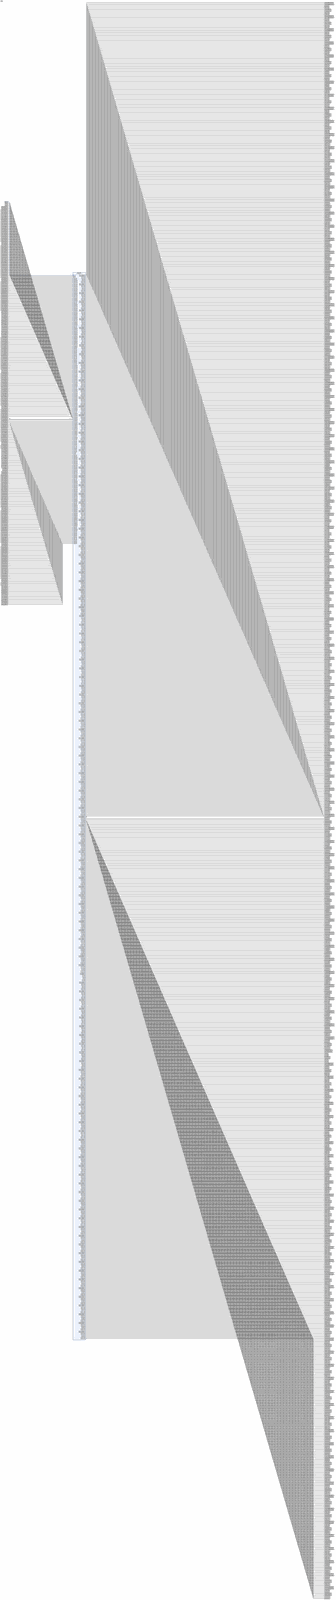
[diagram p0: block diagram of the top level, whole]
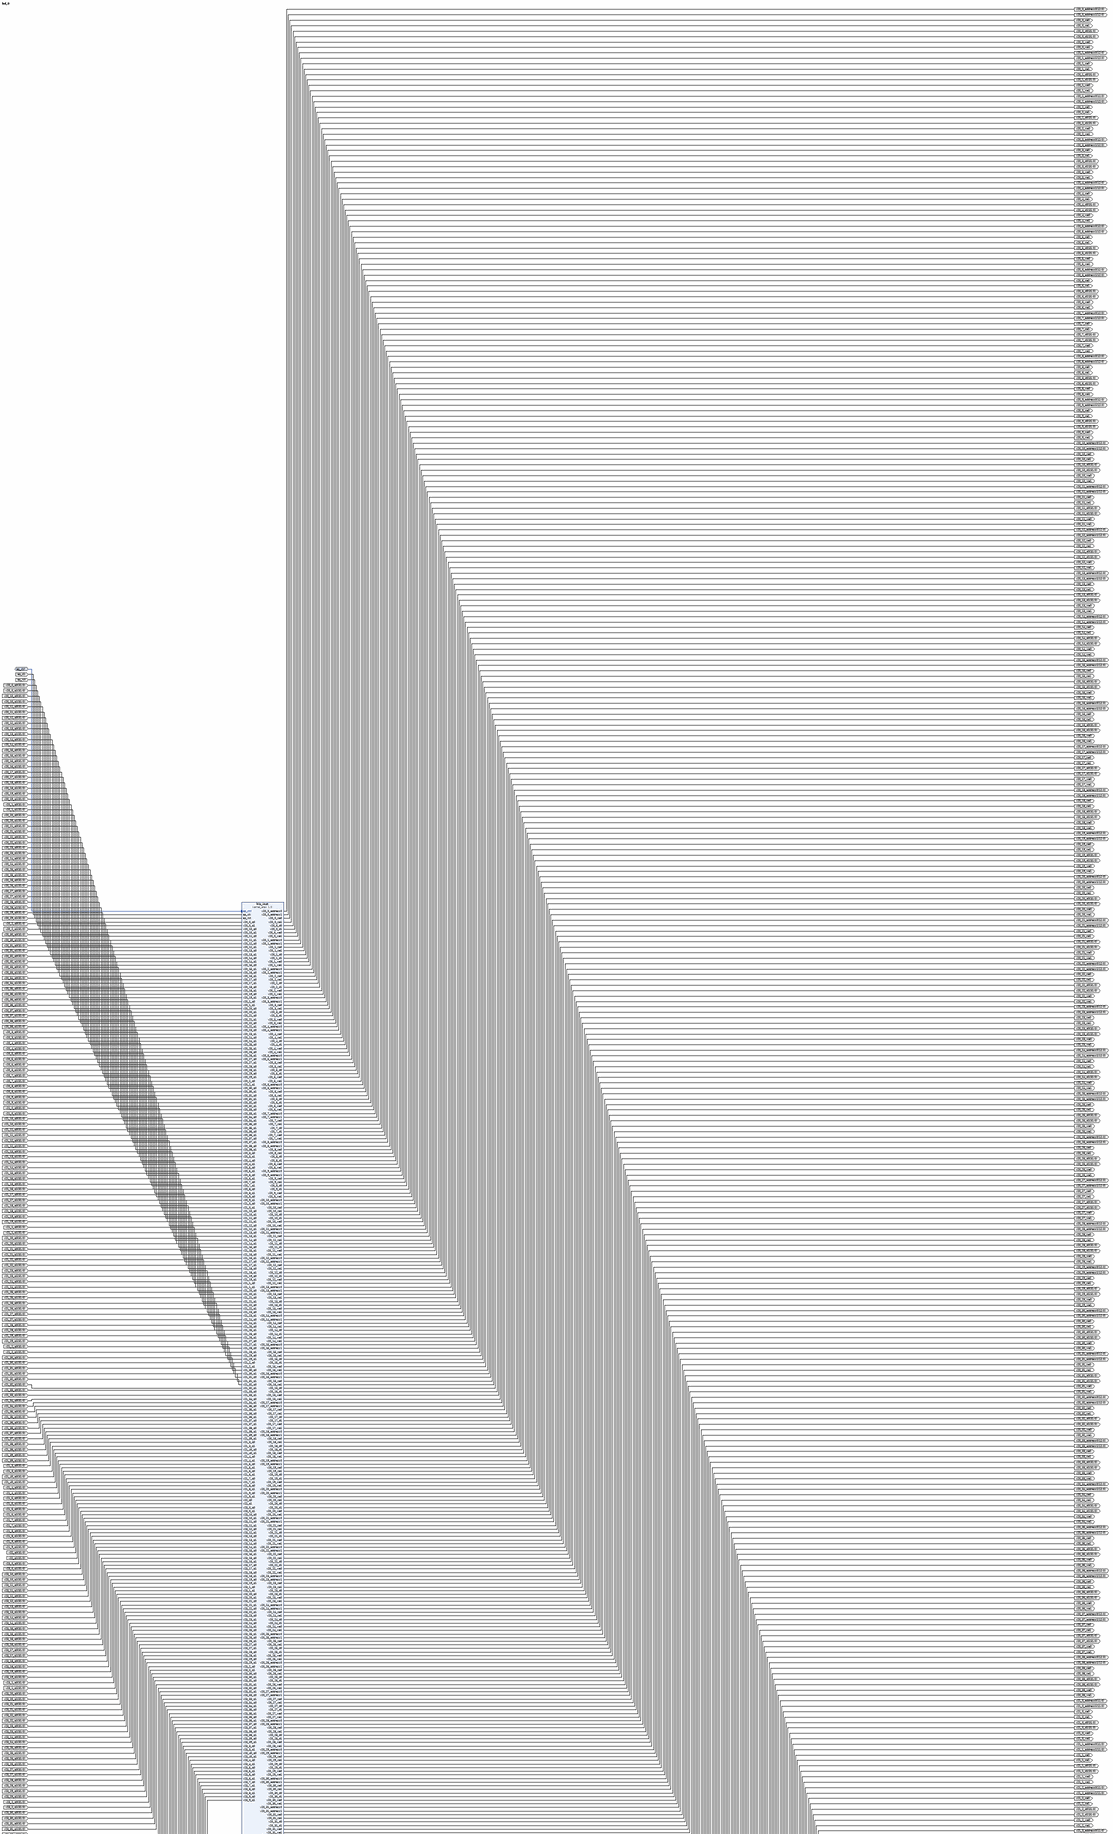
[diagram p1: block diagram of the top level, upper part]
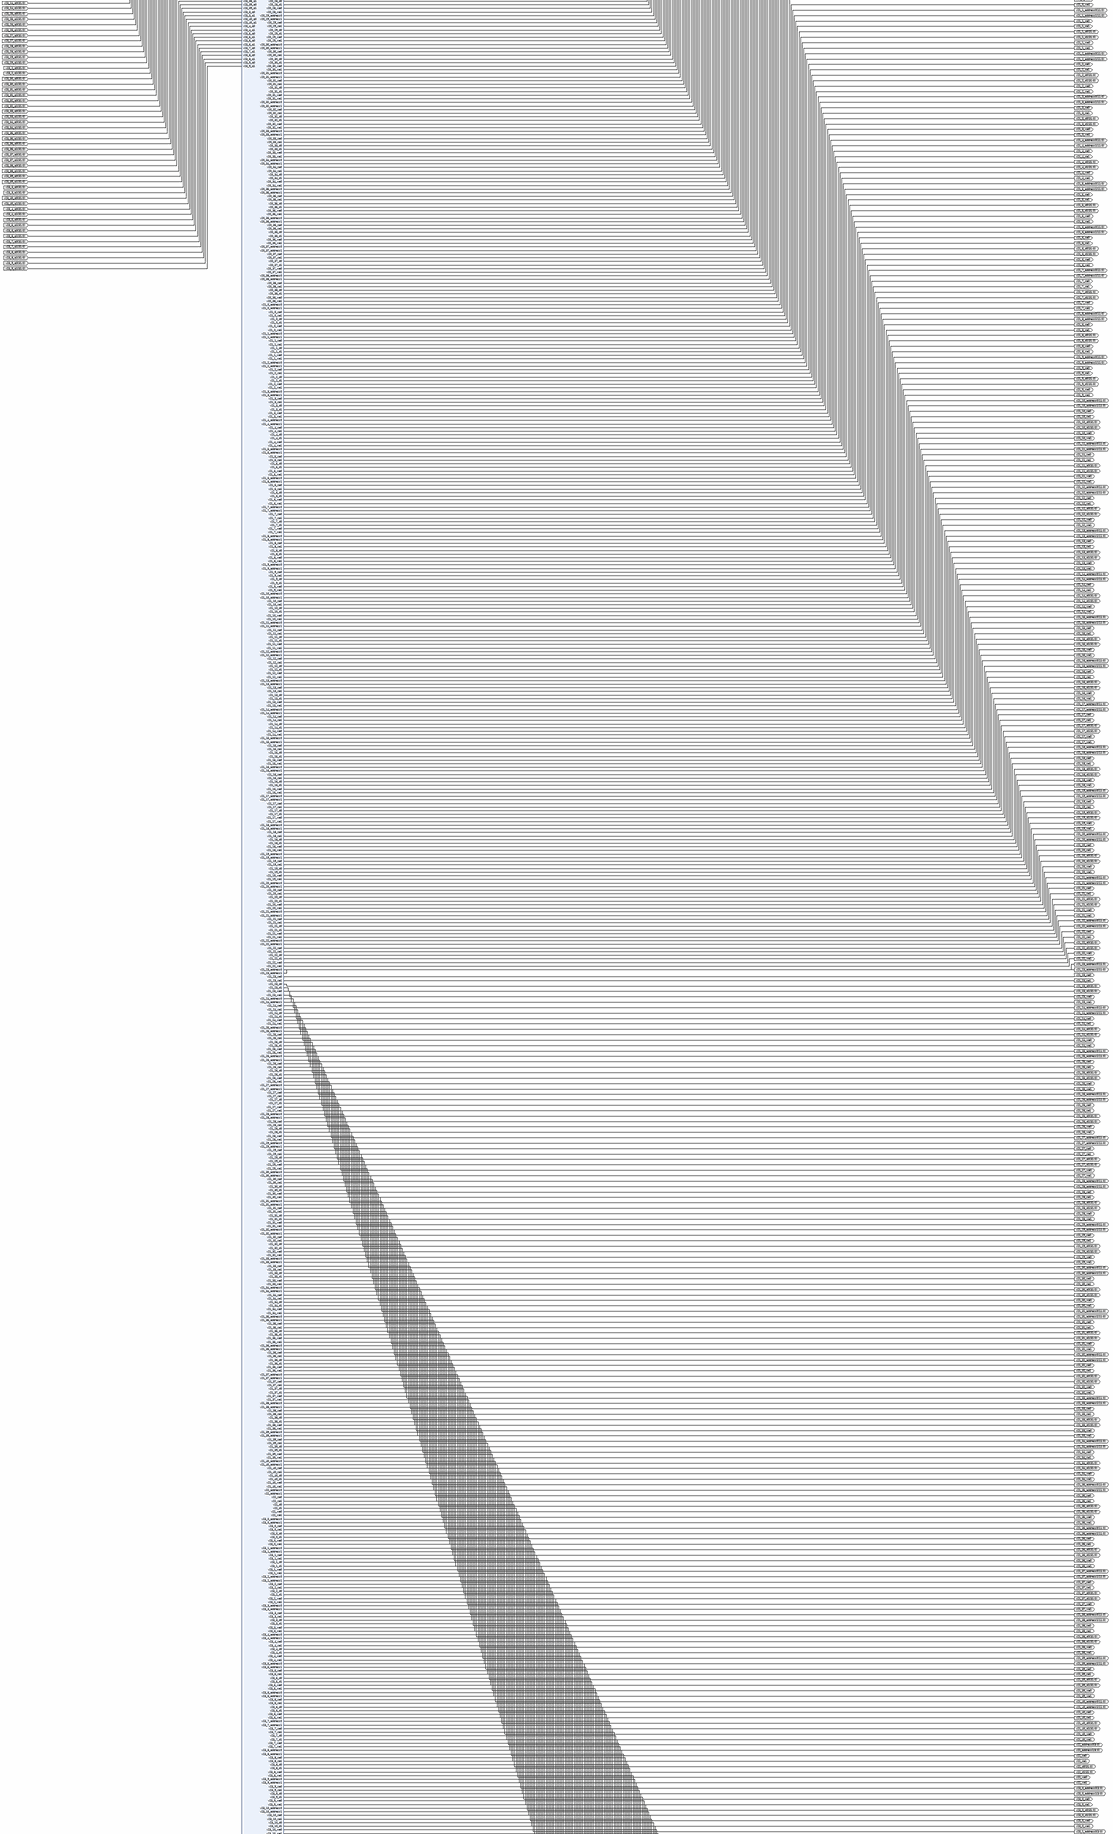
[diagram p2: block diagram of the top level, middle part]
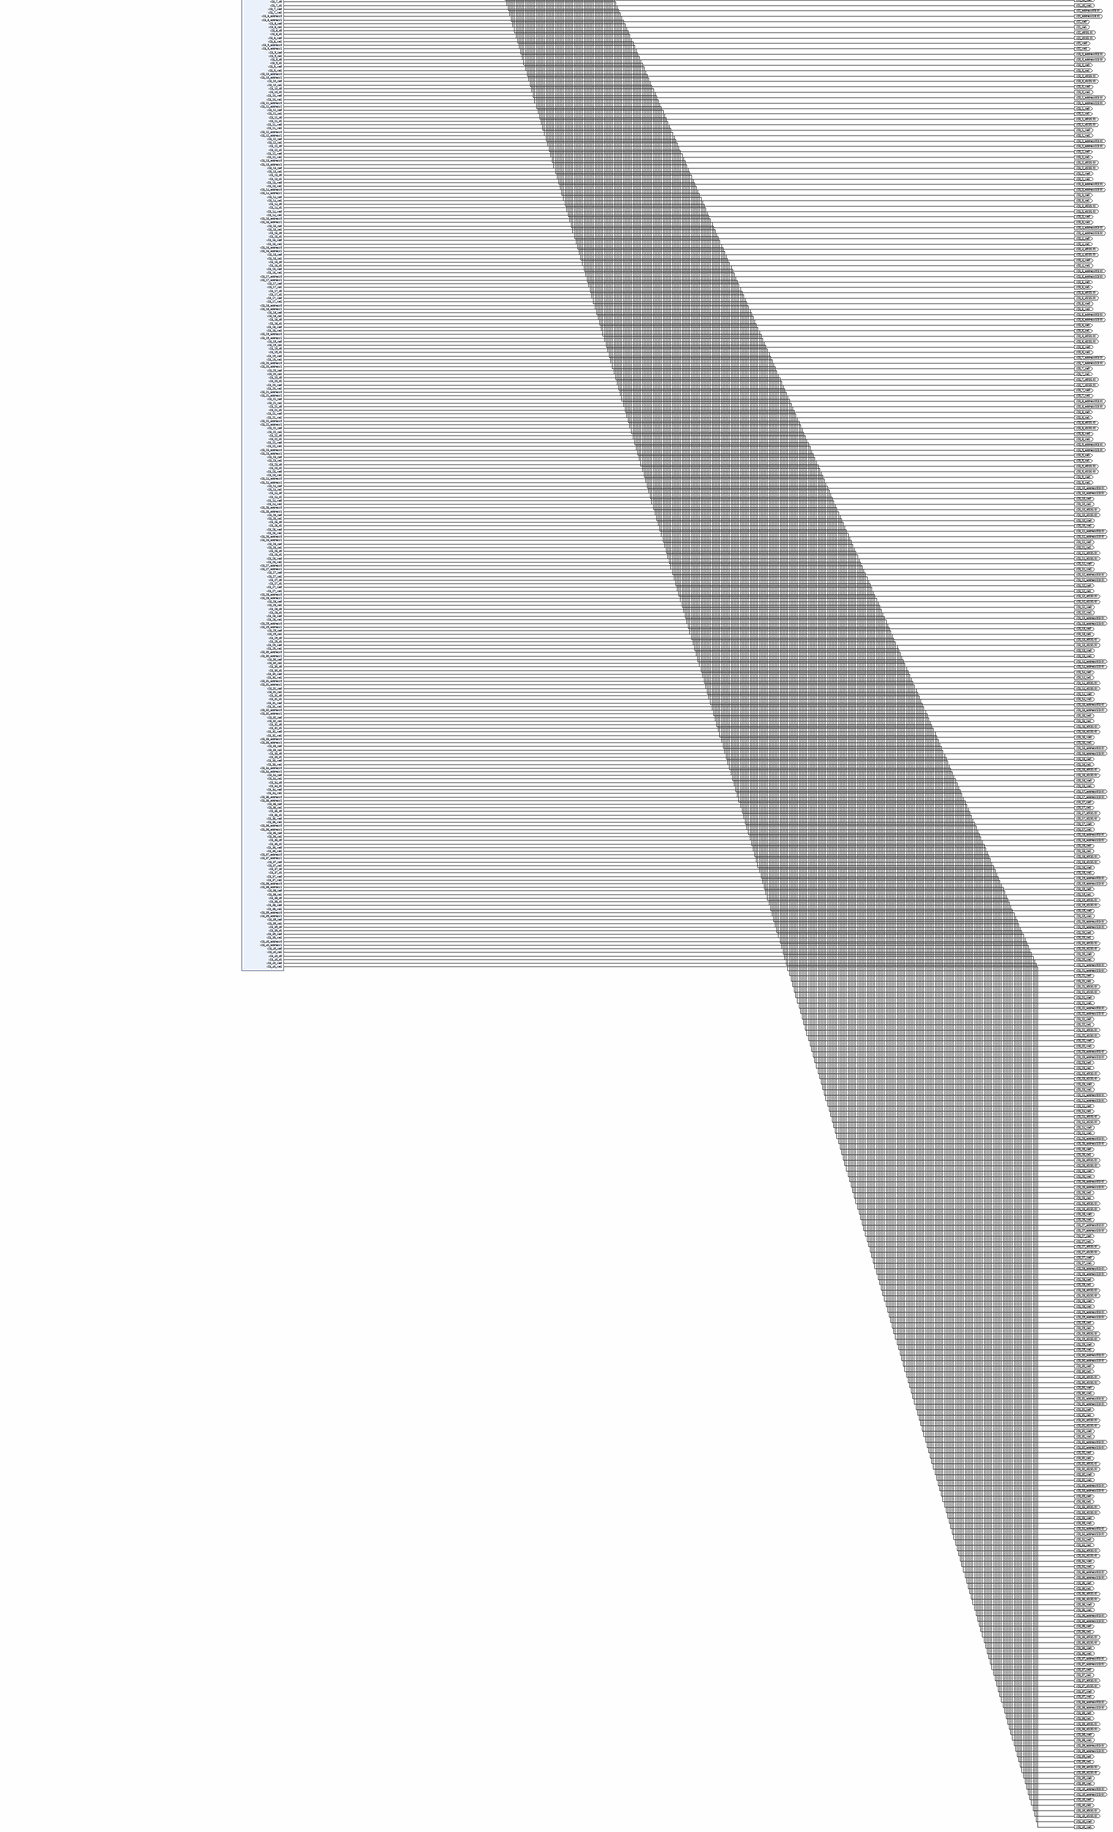
[diagram p3: block diagram of the top level, lower part]
# Vivado block design bd_0, xcu280-fsvh2892-2L-e, Vivado 2022.1.2
create_bd_design bd_0

create_bd_intf_port -mode Slave -vlnv xilinx.com:interface:acc_handshake_rtl:1.0 ap_ctrl
create_bd_port -dir I -type clk ap_clk
set_property -dict {CONFIG.FREQ_HZ 400000000.0} [get_bd_ports ap_clk]
create_bd_port -dir I -type rst ap_rst
set_property -dict {CONFIG.POLARITY ACTIVE_HIGH} [get_bd_ports ap_rst]
create_bd_port -dir O -from 12 -to 0 -type data v20_0_address0
create_bd_port -dir O -from 12 -to 0 -type data v20_0_address1
create_bd_port -dir O v20_0_ce0
create_bd_port -dir O v20_0_ce1
create_bd_port -dir O -from 31 -to 0 -type data v20_0_d0
create_bd_port -dir O -from 31 -to 0 -type data v20_0_d1
create_bd_port -dir I -from 31 -to 0 -type data v20_0_q0
create_bd_port -dir I -from 31 -to 0 -type data v20_0_q1
create_bd_port -dir O v20_0_we0
create_bd_port -dir O v20_0_we1
create_bd_port -dir O -from 12 -to 0 -type data v20_10_address0
create_bd_port -dir O -from 12 -to 0 -type data v20_10_address1
create_bd_port -dir O v20_10_ce0
create_bd_port -dir O v20_10_ce1
create_bd_port -dir O -from 31 -to 0 -type data v20_10_d0
create_bd_port -dir O -from 31 -to 0 -type data v20_10_d1
create_bd_port -dir I -from 31 -to 0 -type data v20_10_q0
create_bd_port -dir I -from 31 -to 0 -type data v20_10_q1
create_bd_port -dir O v20_10_we0
create_bd_port -dir O v20_10_we1
create_bd_port -dir O -from 12 -to 0 -type data v20_11_address0
create_bd_port -dir O -from 12 -to 0 -type data v20_11_address1
create_bd_port -dir O v20_11_ce0
create_bd_port -dir O v20_11_ce1
create_bd_port -dir O -from 31 -to 0 -type data v20_11_d0
create_bd_port -dir O -from 31 -to 0 -type data v20_11_d1
create_bd_port -dir I -from 31 -to 0 -type data v20_11_q0
create_bd_port -dir I -from 31 -to 0 -type data v20_11_q1
create_bd_port -dir O v20_11_we0
create_bd_port -dir O v20_11_we1
create_bd_port -dir O -from 12 -to 0 -type data v20_12_address0
create_bd_port -dir O -from 12 -to 0 -type data v20_12_address1
create_bd_port -dir O v20_12_ce0
create_bd_port -dir O v20_12_ce1
create_bd_port -dir O -from 31 -to 0 -type data v20_12_d0
create_bd_port -dir O -from 31 -to 0 -type data v20_12_d1
create_bd_port -dir I -from 31 -to 0 -type data v20_12_q0
create_bd_port -dir I -from 31 -to 0 -type data v20_12_q1
create_bd_port -dir O v20_12_we0
create_bd_port -dir O v20_12_we1
create_bd_port -dir O -from 12 -to 0 -type data v20_13_address0
create_bd_port -dir O -from 12 -to 0 -type data v20_13_address1
create_bd_port -dir O v20_13_ce0
create_bd_port -dir O v20_13_ce1
create_bd_port -dir O -from 31 -to 0 -type data v20_13_d0
create_bd_port -dir O -from 31 -to 0 -type data v20_13_d1
create_bd_port -dir I -from 31 -to 0 -type data v20_13_q0
create_bd_port -dir I -from 31 -to 0 -type data v20_13_q1
create_bd_port -dir O v20_13_we0
create_bd_port -dir O v20_13_we1
create_bd_port -dir O -from 12 -to 0 -type data v20_14_address0
create_bd_port -dir O -from 12 -to 0 -type data v20_14_address1
create_bd_port -dir O v20_14_ce0
create_bd_port -dir O v20_14_ce1
create_bd_port -dir O -from 31 -to 0 -type data v20_14_d0
create_bd_port -dir O -from 31 -to 0 -type data v20_14_d1
create_bd_port -dir I -from 31 -to 0 -type data v20_14_q0
create_bd_port -dir I -from 31 -to 0 -type data v20_14_q1
create_bd_port -dir O v20_14_we0
create_bd_port -dir O v20_14_we1
create_bd_port -dir O -from 12 -to 0 -type data v20_15_address0
create_bd_port -dir O -from 12 -to 0 -type data v20_15_address1
create_bd_port -dir O v20_15_ce0
create_bd_port -dir O v20_15_ce1
create_bd_port -dir O -from 31 -to 0 -type data v20_15_d0
create_bd_port -dir O -from 31 -to 0 -type data v20_15_d1
create_bd_port -dir I -from 31 -to 0 -type data v20_15_q0
create_bd_port -dir I -from 31 -to 0 -type data v20_15_q1
create_bd_port -dir O v20_15_we0
create_bd_port -dir O v20_15_we1
create_bd_port -dir O -from 12 -to 0 -type data v20_16_address0
create_bd_port -dir O -from 12 -to 0 -type data v20_16_address1
create_bd_port -dir O v20_16_ce0
create_bd_port -dir O v20_16_ce1
create_bd_port -dir O -from 31 -to 0 -type data v20_16_d0
create_bd_port -dir O -from 31 -to 0 -type data v20_16_d1
create_bd_port -dir I -from 31 -to 0 -type data v20_16_q0
create_bd_port -dir I -from 31 -to 0 -type data v20_16_q1
create_bd_port -dir O v20_16_we0
create_bd_port -dir O v20_16_we1
create_bd_port -dir O -from 12 -to 0 -type data v20_17_address0
create_bd_port -dir O -from 12 -to 0 -type data v20_17_address1
create_bd_port -dir O v20_17_ce0
create_bd_port -dir O v20_17_ce1
create_bd_port -dir O -from 31 -to 0 -type data v20_17_d0
create_bd_port -dir O -from 31 -to 0 -type data v20_17_d1
create_bd_port -dir I -from 31 -to 0 -type data v20_17_q0
create_bd_port -dir I -from 31 -to 0 -type data v20_17_q1
create_bd_port -dir O v20_17_we0
create_bd_port -dir O v20_17_we1
create_bd_port -dir O -from 12 -to 0 -type data v20_18_address0
create_bd_port -dir O -from 12 -to 0 -type data v20_18_address1
create_bd_port -dir O v20_18_ce0
create_bd_port -dir O v20_18_ce1
create_bd_port -dir O -from 31 -to 0 -type data v20_18_d0
create_bd_port -dir O -from 31 -to 0 -type data v20_18_d1
create_bd_port -dir I -from 31 -to 0 -type data v20_18_q0
create_bd_port -dir I -from 31 -to 0 -type data v20_18_q1
create_bd_port -dir O v20_18_we0
create_bd_port -dir O v20_18_we1
create_bd_port -dir O -from 12 -to 0 -type data v20_19_address0
create_bd_port -dir O -from 12 -to 0 -type data v20_19_address1
create_bd_port -dir O v20_19_ce0
create_bd_port -dir O v20_19_ce1
create_bd_port -dir O -from 31 -to 0 -type data v20_19_d0
create_bd_port -dir O -from 31 -to 0 -type data v20_19_d1
create_bd_port -dir I -from 31 -to 0 -type data v20_19_q0
create_bd_port -dir I -from 31 -to 0 -type data v20_19_q1
create_bd_port -dir O v20_19_we0
create_bd_port -dir O v20_19_we1
create_bd_port -dir O -from 12 -to 0 -type data v20_1_address0
create_bd_port -dir O -from 12 -to 0 -type data v20_1_address1
create_bd_port -dir O v20_1_ce0
create_bd_port -dir O v20_1_ce1
create_bd_port -dir O -from 31 -to 0 -type data v20_1_d0
create_bd_port -dir O -from 31 -to 0 -type data v20_1_d1
create_bd_port -dir I -from 31 -to 0 -type data v20_1_q0
create_bd_port -dir I -from 31 -to 0 -type data v20_1_q1
create_bd_port -dir O v20_1_we0
create_bd_port -dir O v20_1_we1
create_bd_port -dir O -from 12 -to 0 -type data v20_20_address0
create_bd_port -dir O -from 12 -to 0 -type data v20_20_address1
create_bd_port -dir O v20_20_ce0
create_bd_port -dir O v20_20_ce1
create_bd_port -dir O -from 31 -to 0 -type data v20_20_d0
create_bd_port -dir O -from 31 -to 0 -type data v20_20_d1
create_bd_port -dir I -from 31 -to 0 -type data v20_20_q0
create_bd_port -dir I -from 31 -to 0 -type data v20_20_q1
create_bd_port -dir O v20_20_we0
create_bd_port -dir O v20_20_we1
create_bd_port -dir O -from 12 -to 0 -type data v20_21_address0
create_bd_port -dir O -from 12 -to 0 -type data v20_21_address1
create_bd_port -dir O v20_21_ce0
create_bd_port -dir O v20_21_ce1
create_bd_port -dir O -from 31 -to 0 -type data v20_21_d0
create_bd_port -dir O -from 31 -to 0 -type data v20_21_d1
create_bd_port -dir I -from 31 -to 0 -type data v20_21_q0
create_bd_port -dir I -from 31 -to 0 -type data v20_21_q1
create_bd_port -dir O v20_21_we0
create_bd_port -dir O v20_21_we1
create_bd_port -dir O -from 12 -to 0 -type data v20_22_address0
create_bd_port -dir O -from 12 -to 0 -type data v20_22_address1
create_bd_port -dir O v20_22_ce0
create_bd_port -dir O v20_22_ce1
create_bd_port -dir O -from 31 -to 0 -type data v20_22_d0
create_bd_port -dir O -from 31 -to 0 -type data v20_22_d1
create_bd_port -dir I -from 31 -to 0 -type data v20_22_q0
create_bd_port -dir I -from 31 -to 0 -type data v20_22_q1
create_bd_port -dir O v20_22_we0
create_bd_port -dir O v20_22_we1
create_bd_port -dir O -from 12 -to 0 -type data v20_23_address0
create_bd_port -dir O -from 12 -to 0 -type data v20_23_address1
create_bd_port -dir O v20_23_ce0
create_bd_port -dir O v20_23_ce1
create_bd_port -dir O -from 31 -to 0 -type data v20_23_d0
create_bd_port -dir O -from 31 -to 0 -type data v20_23_d1
create_bd_port -dir I -from 31 -to 0 -type data v20_23_q0
create_bd_port -dir I -from 31 -to 0 -type data v20_23_q1
create_bd_port -dir O v20_23_we0
create_bd_port -dir O v20_23_we1
create_bd_port -dir O -from 12 -to 0 -type data v20_24_address0
create_bd_port -dir O -from 12 -to 0 -type data v20_24_address1
create_bd_port -dir O v20_24_ce0
create_bd_port -dir O v20_24_ce1
create_bd_port -dir O -from 31 -to 0 -type data v20_24_d0
create_bd_port -dir O -from 31 -to 0 -type data v20_24_d1
create_bd_port -dir I -from 31 -to 0 -type data v20_24_q0
create_bd_port -dir I -from 31 -to 0 -type data v20_24_q1
create_bd_port -dir O v20_24_we0
create_bd_port -dir O v20_24_we1
create_bd_port -dir O -from 12 -to 0 -type data v20_25_address0
create_bd_port -dir O -from 12 -to 0 -type data v20_25_address1
create_bd_port -dir O v20_25_ce0
create_bd_port -dir O v20_25_ce1
create_bd_port -dir O -from 31 -to 0 -type data v20_25_d0
create_bd_port -dir O -from 31 -to 0 -type data v20_25_d1
create_bd_port -dir I -from 31 -to 0 -type data v20_25_q0
create_bd_port -dir I -from 31 -to 0 -type data v20_25_q1
create_bd_port -dir O v20_25_we0
create_bd_port -dir O v20_25_we1
create_bd_port -dir O -from 12 -to 0 -type data v20_26_address0
create_bd_port -dir O -from 12 -to 0 -type data v20_26_address1
create_bd_port -dir O v20_26_ce0
create_bd_port -dir O v20_26_ce1
create_bd_port -dir O -from 31 -to 0 -type data v20_26_d0
create_bd_port -dir O -from 31 -to 0 -type data v20_26_d1
create_bd_port -dir I -from 31 -to 0 -type data v20_26_q0
create_bd_port -dir I -from 31 -to 0 -type data v20_26_q1
create_bd_port -dir O v20_26_we0
create_bd_port -dir O v20_26_we1
create_bd_port -dir O -from 12 -to 0 -type data v20_27_address0
create_bd_port -dir O -from 12 -to 0 -type data v20_27_address1
create_bd_port -dir O v20_27_ce0
create_bd_port -dir O v20_27_ce1
create_bd_port -dir O -from 31 -to 0 -type data v20_27_d0
create_bd_port -dir O -from 31 -to 0 -type data v20_27_d1
create_bd_port -dir I -from 31 -to 0 -type data v20_27_q0
create_bd_port -dir I -from 31 -to 0 -type data v20_27_q1
create_bd_port -dir O v20_27_we0
create_bd_port -dir O v20_27_we1
create_bd_port -dir O -from 12 -to 0 -type data v20_28_address0
create_bd_port -dir O -from 12 -to 0 -type data v20_28_address1
create_bd_port -dir O v20_28_ce0
create_bd_port -dir O v20_28_ce1
create_bd_port -dir O -from 31 -to 0 -type data v20_28_d0
create_bd_port -dir O -from 31 -to 0 -type data v20_28_d1
create_bd_port -dir I -from 31 -to 0 -type data v20_28_q0
create_bd_port -dir I -from 31 -to 0 -type data v20_28_q1
create_bd_port -dir O v20_28_we0
create_bd_port -dir O v20_28_we1
create_bd_port -dir O -from 12 -to 0 -type data v20_29_address0
create_bd_port -dir O -from 12 -to 0 -type data v20_29_address1
create_bd_port -dir O v20_29_ce0
create_bd_port -dir O v20_29_ce1
create_bd_port -dir O -from 31 -to 0 -type data v20_29_d0
create_bd_port -dir O -from 31 -to 0 -type data v20_29_d1
create_bd_port -dir I -from 31 -to 0 -type data v20_29_q0
create_bd_port -dir I -from 31 -to 0 -type data v20_29_q1
create_bd_port -dir O v20_29_we0
create_bd_port -dir O v20_29_we1
create_bd_port -dir O -from 12 -to 0 -type data v20_2_address0
create_bd_port -dir O -from 12 -to 0 -type data v20_2_address1
create_bd_port -dir O v20_2_ce0
create_bd_port -dir O v20_2_ce1
create_bd_port -dir O -from 31 -to 0 -type data v20_2_d0
create_bd_port -dir O -from 31 -to 0 -type data v20_2_d1
create_bd_port -dir I -from 31 -to 0 -type data v20_2_q0
create_bd_port -dir I -from 31 -to 0 -type data v20_2_q1
create_bd_port -dir O v20_2_we0
create_bd_port -dir O v20_2_we1
create_bd_port -dir O -from 12 -to 0 -type data v20_30_address0
create_bd_port -dir O -from 12 -to 0 -type data v20_30_address1
create_bd_port -dir O v20_30_ce0
create_bd_port -dir O v20_30_ce1
create_bd_port -dir O -from 31 -to 0 -type data v20_30_d0
create_bd_port -dir O -from 31 -to 0 -type data v20_30_d1
create_bd_port -dir I -from 31 -to 0 -type data v20_30_q0
create_bd_port -dir I -from 31 -to 0 -type data v20_30_q1
create_bd_port -dir O v20_30_we0
create_bd_port -dir O v20_30_we1
create_bd_port -dir O -from 12 -to 0 -type data v20_31_address0
create_bd_port -dir O -from 12 -to 0 -type data v20_31_address1
create_bd_port -dir O v20_31_ce0
create_bd_port -dir O v20_31_ce1
create_bd_port -dir O -from 31 -to 0 -type data v20_31_d0
create_bd_port -dir O -from 31 -to 0 -type data v20_31_d1
create_bd_port -dir I -from 31 -to 0 -type data v20_31_q0
create_bd_port -dir I -from 31 -to 0 -type data v20_31_q1
create_bd_port -dir O v20_31_we0
create_bd_port -dir O v20_31_we1
create_bd_port -dir O -from 12 -to 0 -type data v20_32_address0
create_bd_port -dir O -from 12 -to 0 -type data v20_32_address1
create_bd_port -dir O v20_32_ce0
create_bd_port -dir O v20_32_ce1
create_bd_port -dir O -from 31 -to 0 -type data v20_32_d0
create_bd_port -dir O -from 31 -to 0 -type data v20_32_d1
create_bd_port -dir I -from 31 -to 0 -type data v20_32_q0
create_bd_port -dir I -from 31 -to 0 -type data v20_32_q1
create_bd_port -dir O v20_32_we0
create_bd_port -dir O v20_32_we1
create_bd_port -dir O -from 12 -to 0 -type data v20_33_address0
create_bd_port -dir O -from 12 -to 0 -type data v20_33_address1
create_bd_port -dir O v20_33_ce0
create_bd_port -dir O v20_33_ce1
create_bd_port -dir O -from 31 -to 0 -type data v20_33_d0
create_bd_port -dir O -from 31 -to 0 -type data v20_33_d1
create_bd_port -dir I -from 31 -to 0 -type data v20_33_q0
create_bd_port -dir I -from 31 -to 0 -type data v20_33_q1
create_bd_port -dir O v20_33_we0
create_bd_port -dir O v20_33_we1
create_bd_port -dir O -from 12 -to 0 -type data v20_34_address0
create_bd_port -dir O -from 12 -to 0 -type data v20_34_address1
create_bd_port -dir O v20_34_ce0
create_bd_port -dir O v20_34_ce1
create_bd_port -dir O -from 31 -to 0 -type data v20_34_d0
create_bd_port -dir O -from 31 -to 0 -type data v20_34_d1
create_bd_port -dir I -from 31 -to 0 -type data v20_34_q0
create_bd_port -dir I -from 31 -to 0 -type data v20_34_q1
create_bd_port -dir O v20_34_we0
create_bd_port -dir O v20_34_we1
create_bd_port -dir O -from 12 -to 0 -type data v20_35_address0
create_bd_port -dir O -from 12 -to 0 -type data v20_35_address1
create_bd_port -dir O v20_35_ce0
create_bd_port -dir O v20_35_ce1
create_bd_port -dir O -from 31 -to 0 -type data v20_35_d0
create_bd_port -dir O -from 31 -to 0 -type data v20_35_d1
create_bd_port -dir I -from 31 -to 0 -type data v20_35_q0
create_bd_port -dir I -from 31 -to 0 -type data v20_35_q1
create_bd_port -dir O v20_35_we0
create_bd_port -dir O v20_35_we1
create_bd_port -dir O -from 12 -to 0 -type data v20_36_address0
create_bd_port -dir O -from 12 -to 0 -type data v20_36_address1
create_bd_port -dir O v20_36_ce0
create_bd_port -dir O v20_36_ce1
create_bd_port -dir O -from 31 -to 0 -type data v20_36_d0
create_bd_port -dir O -from 31 -to 0 -type data v20_36_d1
create_bd_port -dir I -from 31 -to 0 -type data v20_36_q0
create_bd_port -dir I -from 31 -to 0 -type data v20_36_q1
create_bd_port -dir O v20_36_we0
create_bd_port -dir O v20_36_we1
create_bd_port -dir O -from 12 -to 0 -type data v20_37_address0
create_bd_port -dir O -from 12 -to 0 -type data v20_37_address1
create_bd_port -dir O v20_37_ce0
create_bd_port -dir O v20_37_ce1
create_bd_port -dir O -from 31 -to 0 -type data v20_37_d0
create_bd_port -dir O -from 31 -to 0 -type data v20_37_d1
create_bd_port -dir I -from 31 -to 0 -type data v20_37_q0
create_bd_port -dir I -from 31 -to 0 -type data v20_37_q1
create_bd_port -dir O v20_37_we0
create_bd_port -dir O v20_37_we1
create_bd_port -dir O -from 12 -to 0 -type data v20_38_address0
create_bd_port -dir O -from 12 -to 0 -type data v20_38_address1
create_bd_port -dir O v20_38_ce0
create_bd_port -dir O v20_38_ce1
create_bd_port -dir O -from 31 -to 0 -type data v20_38_d0
create_bd_port -dir O -from 31 -to 0 -type data v20_38_d1
create_bd_port -dir I -from 31 -to 0 -type data v20_38_q0
create_bd_port -dir I -from 31 -to 0 -type data v20_38_q1
create_bd_port -dir O v20_38_we0
create_bd_port -dir O v20_38_we1
create_bd_port -dir O -from 12 -to 0 -type data v20_3_address0
create_bd_port -dir O -from 12 -to 0 -type data v20_3_address1
create_bd_port -dir O v20_3_ce0
create_bd_port -dir O v20_3_ce1
create_bd_port -dir O -from 31 -to 0 -type data v20_3_d0
create_bd_port -dir O -from 31 -to 0 -type data v20_3_d1
create_bd_port -dir I -from 31 -to 0 -type data v20_3_q0
create_bd_port -dir I -from 31 -to 0 -type data v20_3_q1
create_bd_port -dir O v20_3_we0
create_bd_port -dir O v20_3_we1
create_bd_port -dir O -from 12 -to 0 -type data v20_4_address0
create_bd_port -dir O -from 12 -to 0 -type data v20_4_address1
create_bd_port -dir O v20_4_ce0
create_bd_port -dir O v20_4_ce1
create_bd_port -dir O -from 31 -to 0 -type data v20_4_d0
create_bd_port -dir O -from 31 -to 0 -type data v20_4_d1
create_bd_port -dir I -from 31 -to 0 -type data v20_4_q0
create_bd_port -dir I -from 31 -to 0 -type data v20_4_q1
create_bd_port -dir O v20_4_we0
create_bd_port -dir O v20_4_we1
create_bd_port -dir O -from 12 -to 0 -type data v20_5_address0
create_bd_port -dir O -from 12 -to 0 -type data v20_5_address1
create_bd_port -dir O v20_5_ce0
create_bd_port -dir O v20_5_ce1
create_bd_port -dir O -from 31 -to 0 -type data v20_5_d0
create_bd_port -dir O -from 31 -to 0 -type data v20_5_d1
create_bd_port -dir I -from 31 -to 0 -type data v20_5_q0
create_bd_port -dir I -from 31 -to 0 -type data v20_5_q1
create_bd_port -dir O v20_5_we0
create_bd_port -dir O v20_5_we1
create_bd_port -dir O -from 12 -to 0 -type data v20_6_address0
create_bd_port -dir O -from 12 -to 0 -type data v20_6_address1
create_bd_port -dir O v20_6_ce0
create_bd_port -dir O v20_6_ce1
create_bd_port -dir O -from 31 -to 0 -type data v20_6_d0
create_bd_port -dir O -from 31 -to 0 -type data v20_6_d1
create_bd_port -dir I -from 31 -to 0 -type data v20_6_q0
create_bd_port -dir I -from 31 -to 0 -type data v20_6_q1
create_bd_port -dir O v20_6_we0
create_bd_port -dir O v20_6_we1
create_bd_port -dir O -from 12 -to 0 -type data v20_7_address0
create_bd_port -dir O -from 12 -to 0 -type data v20_7_address1
create_bd_port -dir O v20_7_ce0
create_bd_port -dir O v20_7_ce1
create_bd_port -dir O -from 31 -to 0 -type data v20_7_d0
create_bd_port -dir O -from 31 -to 0 -type data v20_7_d1
create_bd_port -dir I -from 31 -to 0 -type data v20_7_q0
create_bd_port -dir I -from 31 -to 0 -type data v20_7_q1
create_bd_port -dir O v20_7_we0
create_bd_port -dir O v20_7_we1
create_bd_port -dir O -from 12 -to 0 -type data v20_8_address0
create_bd_port -dir O -from 12 -to 0 -type data v20_8_address1
create_bd_port -dir O v20_8_ce0
create_bd_port -dir O v20_8_ce1
create_bd_port -dir O -from 31 -to 0 -type data v20_8_d0
create_bd_port -dir O -from 31 -to 0 -type data v20_8_d1
create_bd_port -dir I -from 31 -to 0 -type data v20_8_q0
create_bd_port -dir I -from 31 -to 0 -type data v20_8_q1
create_bd_port -dir O v20_8_we0
create_bd_port -dir O v20_8_we1
create_bd_port -dir O -from 12 -to 0 -type data v20_9_address0
create_bd_port -dir O -from 12 -to 0 -type data v20_9_address1
create_bd_port -dir O v20_9_ce0
create_bd_port -dir O v20_9_ce1
create_bd_port -dir O -from 31 -to 0 -type data v20_9_d0
create_bd_port -dir O -from 31 -to 0 -type data v20_9_d1
create_bd_port -dir I -from 31 -to 0 -type data v20_9_q0
create_bd_port -dir I -from 31 -to 0 -type data v20_9_q1
create_bd_port -dir O v20_9_we0
create_bd_port -dir O v20_9_we1
create_bd_port -dir O -from 11 -to 0 -type data v21_0_address0
create_bd_port -dir O -from 11 -to 0 -type data v21_0_address1
create_bd_port -dir O v21_0_ce0
create_bd_port -dir O v21_0_ce1
create_bd_port -dir O -from 31 -to 0 -type data v21_0_d0
create_bd_port -dir O -from 31 -to 0 -type data v21_0_d1
create_bd_port -dir I -from 31 -to 0 -type data v21_0_q0
create_bd_port -dir I -from 31 -to 0 -type data v21_0_q1
create_bd_port -dir O v21_0_we0
create_bd_port -dir O v21_0_we1
create_bd_port -dir O -from 11 -to 0 -type data v21_10_address0
create_bd_port -dir O -from 11 -to 0 -type data v21_10_address1
create_bd_port -dir O v21_10_ce0
create_bd_port -dir O v21_10_ce1
create_bd_port -dir O -from 31 -to 0 -type data v21_10_d0
create_bd_port -dir O -from 31 -to 0 -type data v21_10_d1
create_bd_port -dir I -from 31 -to 0 -type data v21_10_q0
create_bd_port -dir I -from 31 -to 0 -type data v21_10_q1
create_bd_port -dir O v21_10_we0
create_bd_port -dir O v21_10_we1
create_bd_port -dir O -from 11 -to 0 -type data v21_11_address0
create_bd_port -dir O -from 11 -to 0 -type data v21_11_address1
create_bd_port -dir O v21_11_ce0
create_bd_port -dir O v21_11_ce1
create_bd_port -dir O -from 31 -to 0 -type data v21_11_d0
create_bd_port -dir O -from 31 -to 0 -type data v21_11_d1
create_bd_port -dir I -from 31 -to 0 -type data v21_11_q0
create_bd_port -dir I -from 31 -to 0 -type data v21_11_q1
create_bd_port -dir O v21_11_we0
create_bd_port -dir O v21_11_we1
create_bd_port -dir O -from 11 -to 0 -type data v21_12_address0
create_bd_port -dir O -from 11 -to 0 -type data v21_12_address1
create_bd_port -dir O v21_12_ce0
create_bd_port -dir O v21_12_ce1
create_bd_port -dir O -from 31 -to 0 -type data v21_12_d0
create_bd_port -dir O -from 31 -to 0 -type data v21_12_d1
create_bd_port -dir I -from 31 -to 0 -type data v21_12_q0
create_bd_port -dir I -from 31 -to 0 -type data v21_12_q1
create_bd_port -dir O v21_12_we0
create_bd_port -dir O v21_12_we1
create_bd_port -dir O -from 11 -to 0 -type data v21_13_address0
create_bd_port -dir O -from 11 -to 0 -type data v21_13_address1
create_bd_port -dir O v21_13_ce0
create_bd_port -dir O v21_13_ce1
create_bd_port -dir O -from 31 -to 0 -type data v21_13_d0
create_bd_port -dir O -from 31 -to 0 -type data v21_13_d1
create_bd_port -dir I -from 31 -to 0 -type data v21_13_q0
create_bd_port -dir I -from 31 -to 0 -type data v21_13_q1
create_bd_port -dir O v21_13_we0
create_bd_port -dir O v21_13_we1
create_bd_port -dir O -from 11 -to 0 -type data v21_14_address0
create_bd_port -dir O -from 11 -to 0 -type data v21_14_address1
create_bd_port -dir O v21_14_ce0
create_bd_port -dir O v21_14_ce1
create_bd_port -dir O -from 31 -to 0 -type data v21_14_d0
create_bd_port -dir O -from 31 -to 0 -type data v21_14_d1
create_bd_port -dir I -from 31 -to 0 -type data v21_14_q0
create_bd_port -dir I -from 31 -to 0 -type data v21_14_q1
create_bd_port -dir O v21_14_we0
create_bd_port -dir O v21_14_we1
create_bd_port -dir O -from 11 -to 0 -type data v21_15_address0
create_bd_port -dir O -from 11 -to 0 -type data v21_15_address1
create_bd_port -dir O v21_15_ce0
create_bd_port -dir O v21_15_ce1
create_bd_port -dir O -from 31 -to 0 -type data v21_15_d0
create_bd_port -dir O -from 31 -to 0 -type data v21_15_d1
create_bd_port -dir I -from 31 -to 0 -type data v21_15_q0
create_bd_port -dir I -from 31 -to 0 -type data v21_15_q1
create_bd_port -dir O v21_15_we0
create_bd_port -dir O v21_15_we1
create_bd_port -dir O -from 11 -to 0 -type data v21_16_address0
create_bd_port -dir O -from 11 -to 0 -type data v21_16_address1
create_bd_port -dir O v21_16_ce0
create_bd_port -dir O v21_16_ce1
create_bd_port -dir O -from 31 -to 0 -type data v21_16_d0
create_bd_port -dir O -from 31 -to 0 -type data v21_16_d1
create_bd_port -dir I -from 31 -to 0 -type data v21_16_q0
create_bd_port -dir I -from 31 -to 0 -type data v21_16_q1
create_bd_port -dir O v21_16_we0
create_bd_port -dir O v21_16_we1
create_bd_port -dir O -from 11 -to 0 -type data v21_17_address0
create_bd_port -dir O -from 11 -to 0 -type data v21_17_address1
create_bd_port -dir O v21_17_ce0
create_bd_port -dir O v21_17_ce1
create_bd_port -dir O -from 31 -to 0 -type data v21_17_d0
create_bd_port -dir O -from 31 -to 0 -type data v21_17_d1
create_bd_port -dir I -from 31 -to 0 -type data v21_17_q0
create_bd_port -dir I -from 31 -to 0 -type data v21_17_q1
create_bd_port -dir O v21_17_we0
create_bd_port -dir O v21_17_we1
create_bd_port -dir O -from 11 -to 0 -type data v21_18_address0
create_bd_port -dir O -from 11 -to 0 -type data v21_18_address1
create_bd_port -dir O v21_18_ce0
create_bd_port -dir O v21_18_ce1
create_bd_port -dir O -from 31 -to 0 -type data v21_18_d0
create_bd_port -dir O -from 31 -to 0 -type data v21_18_d1
create_bd_port -dir I -from 31 -to 0 -type data v21_18_q0
create_bd_port -dir I -from 31 -to 0 -type data v21_18_q1
create_bd_port -dir O v21_18_we0
create_bd_port -dir O v21_18_we1
create_bd_port -dir O -from 11 -to 0 -type data v21_19_address0
create_bd_port -dir O -from 11 -to 0 -type data v21_19_address1
create_bd_port -dir O v21_19_ce0
create_bd_port -dir O v21_19_ce1
create_bd_port -dir O -from 31 -to 0 -type data v21_19_d0
create_bd_port -dir O -from 31 -to 0 -type data v21_19_d1
create_bd_port -dir I -from 31 -to 0 -type data v21_19_q0
create_bd_port -dir I -from 31 -to 0 -type data v21_19_q1
create_bd_port -dir O v21_19_we0
create_bd_port -dir O v21_19_we1
create_bd_port -dir O -from 11 -to 0 -type data v21_1_address0
create_bd_port -dir O -from 11 -to 0 -type data v21_1_address1
create_bd_port -dir O v21_1_ce0
create_bd_port -dir O v21_1_ce1
create_bd_port -dir O -from 31 -to 0 -type data v21_1_d0
create_bd_port -dir O -from 31 -to 0 -type data v21_1_d1
create_bd_port -dir I -from 31 -to 0 -type data v21_1_q0
create_bd_port -dir I -from 31 -to 0 -type data v21_1_q1
create_bd_port -dir O v21_1_we0
create_bd_port -dir O v21_1_we1
create_bd_port -dir O -from 11 -to 0 -type data v21_20_address0
create_bd_port -dir O -from 11 -to 0 -type data v21_20_address1
create_bd_port -dir O v21_20_ce0
create_bd_port -dir O v21_20_ce1
create_bd_port -dir O -from 31 -to 0 -type data v21_20_d0
create_bd_port -dir O -from 31 -to 0 -type data v21_20_d1
create_bd_port -dir I -from 31 -to 0 -type data v21_20_q0
create_bd_port -dir I -from 31 -to 0 -type data v21_20_q1
create_bd_port -dir O v21_20_we0
create_bd_port -dir O v21_20_we1
create_bd_port -dir O -from 11 -to 0 -type data v21_21_address0
create_bd_port -dir O -from 11 -to 0 -type data v21_21_address1
create_bd_port -dir O v21_21_ce0
create_bd_port -dir O v21_21_ce1
create_bd_port -dir O -from 31 -to 0 -type data v21_21_d0
create_bd_port -dir O -from 31 -to 0 -type data v21_21_d1
create_bd_port -dir I -from 31 -to 0 -type data v21_21_q0
create_bd_port -dir I -from 31 -to 0 -type data v21_21_q1
create_bd_port -dir O v21_21_we0
create_bd_port -dir O v21_21_we1
create_bd_port -dir O -from 11 -to 0 -type data v21_22_address0
create_bd_port -dir O -from 11 -to 0 -type data v21_22_address1
create_bd_port -dir O v21_22_ce0
create_bd_port -dir O v21_22_ce1
create_bd_port -dir O -from 31 -to 0 -type data v21_22_d0
create_bd_port -dir O -from 31 -to 0 -type data v21_22_d1
create_bd_port -dir I -from 31 -to 0 -type data v21_22_q0
create_bd_port -dir I -from 31 -to 0 -type data v21_22_q1
create_bd_port -dir O v21_22_we0
create_bd_port -dir O v21_22_we1
create_bd_port -dir O -from 11 -to 0 -type data v21_23_address0
create_bd_port -dir O -from 11 -to 0 -type data v21_23_address1
create_bd_port -dir O v21_23_ce0
create_bd_port -dir O v21_23_ce1
create_bd_port -dir O -from 31 -to 0 -type data v21_23_d0
create_bd_port -dir O -from 31 -to 0 -type data v21_23_d1
create_bd_port -dir I -from 31 -to 0 -type data v21_23_q0
create_bd_port -dir I -from 31 -to 0 -type data v21_23_q1
create_bd_port -dir O v21_23_we0
create_bd_port -dir O v21_23_we1
create_bd_port -dir O -from 11 -to 0 -type data v21_24_address0
create_bd_port -dir O -from 11 -to 0 -type data v21_24_address1
create_bd_port -dir O v21_24_ce0
create_bd_port -dir O v21_24_ce1
create_bd_port -dir O -from 31 -to 0 -type data v21_24_d0
create_bd_port -dir O -from 31 -to 0 -type data v21_24_d1
create_bd_port -dir I -from 31 -to 0 -type data v21_24_q0
create_bd_port -dir I -from 31 -to 0 -type data v21_24_q1
create_bd_port -dir O v21_24_we0
create_bd_port -dir O v21_24_we1
create_bd_port -dir O -from 11 -to 0 -type data v21_25_address0
create_bd_port -dir O -from 11 -to 0 -type data v21_25_address1
create_bd_port -dir O v21_25_ce0
create_bd_port -dir O v21_25_ce1
create_bd_port -dir O -from 31 -to 0 -type data v21_25_d0
create_bd_port -dir O -from 31 -to 0 -type data v21_25_d1
create_bd_port -dir I -from 31 -to 0 -type data v21_25_q0
create_bd_port -dir I -from 31 -to 0 -type data v21_25_q1
create_bd_port -dir O v21_25_we0
create_bd_port -dir O v21_25_we1
create_bd_port -dir O -from 11 -to 0 -type data v21_26_address0
create_bd_port -dir O -from 11 -to 0 -type data v21_26_address1
create_bd_port -dir O v21_26_ce0
create_bd_port -dir O v21_26_ce1
create_bd_port -dir O -from 31 -to 0 -type data v21_26_d0
create_bd_port -dir O -from 31 -to 0 -type data v21_26_d1
create_bd_port -dir I -from 31 -to 0 -type data v21_26_q0
create_bd_port -dir I -from 31 -to 0 -type data v21_26_q1
create_bd_port -dir O v21_26_we0
create_bd_port -dir O v21_26_we1
create_bd_port -dir O -from 11 -to 0 -type data v21_27_address0
create_bd_port -dir O -from 11 -to 0 -type data v21_27_address1
create_bd_port -dir O v21_27_ce0
create_bd_port -dir O v21_27_ce1
create_bd_port -dir O -from 31 -to 0 -type data v21_27_d0
create_bd_port -dir O -from 31 -to 0 -type data v21_27_d1
create_bd_port -dir I -from 31 -to 0 -type data v21_27_q0
create_bd_port -dir I -from 31 -to 0 -type data v21_27_q1
create_bd_port -dir O v21_27_we0
create_bd_port -dir O v21_27_we1
create_bd_port -dir O -from 11 -to 0 -type data v21_28_address0
create_bd_port -dir O -from 11 -to 0 -type data v21_28_address1
create_bd_port -dir O v21_28_ce0
create_bd_port -dir O v21_28_ce1
create_bd_port -dir O -from 31 -to 0 -type data v21_28_d0
create_bd_port -dir O -from 31 -to 0 -type data v21_28_d1
create_bd_port -dir I -from 31 -to 0 -type data v21_28_q0
create_bd_port -dir I -from 31 -to 0 -type data v21_28_q1
create_bd_port -dir O v21_28_we0
create_bd_port -dir O v21_28_we1
create_bd_port -dir O -from 11 -to 0 -type data v21_29_address0
create_bd_port -dir O -from 11 -to 0 -type data v21_29_address1
create_bd_port -dir O v21_29_ce0
create_bd_port -dir O v21_29_ce1
create_bd_port -dir O -from 31 -to 0 -type data v21_29_d0
create_bd_port -dir O -from 31 -to 0 -type data v21_29_d1
create_bd_port -dir I -from 31 -to 0 -type data v21_29_q0
create_bd_port -dir I -from 31 -to 0 -type data v21_29_q1
create_bd_port -dir O v21_29_we0
create_bd_port -dir O v21_29_we1
create_bd_port -dir O -from 11 -to 0 -type data v21_2_address0
create_bd_port -dir O -from 11 -to 0 -type data v21_2_address1
create_bd_port -dir O v21_2_ce0
create_bd_port -dir O v21_2_ce1
create_bd_port -dir O -from 31 -to 0 -type data v21_2_d0
create_bd_port -dir O -from 31 -to 0 -type data v21_2_d1
create_bd_port -dir I -from 31 -to 0 -type data v21_2_q0
create_bd_port -dir I -from 31 -to 0 -type data v21_2_q1
create_bd_port -dir O v21_2_we0
create_bd_port -dir O v21_2_we1
create_bd_port -dir O -from 11 -to 0 -type data v21_30_address0
create_bd_port -dir O -from 11 -to 0 -type data v21_30_address1
create_bd_port -dir O v21_30_ce0
create_bd_port -dir O v21_30_ce1
create_bd_port -dir O -from 31 -to 0 -type data v21_30_d0
create_bd_port -dir O -from 31 -to 0 -type data v21_30_d1
create_bd_port -dir I -from 31 -to 0 -type data v21_30_q0
create_bd_port -dir I -from 31 -to 0 -type data v21_30_q1
create_bd_port -dir O v21_30_we0
create_bd_port -dir O v21_30_we1
create_bd_port -dir O -from 11 -to 0 -type data v21_31_address0
create_bd_port -dir O -from 11 -to 0 -type data v21_31_address1
create_bd_port -dir O v21_31_ce0
create_bd_port -dir O v21_31_ce1
create_bd_port -dir O -from 31 -to 0 -type data v21_31_d0
create_bd_port -dir O -from 31 -to 0 -type data v21_31_d1
create_bd_port -dir I -from 31 -to 0 -type data v21_31_q0
create_bd_port -dir I -from 31 -to 0 -type data v21_31_q1
create_bd_port -dir O v21_31_we0
create_bd_port -dir O v21_31_we1
create_bd_port -dir O -from 11 -to 0 -type data v21_32_address0
create_bd_port -dir O -from 11 -to 0 -type data v21_32_address1
create_bd_port -dir O v21_32_ce0
create_bd_port -dir O v21_32_ce1
create_bd_port -dir O -from 31 -to 0 -type data v21_32_d0
create_bd_port -dir O -from 31 -to 0 -type data v21_32_d1
create_bd_port -dir I -from 31 -to 0 -type data v21_32_q0
create_bd_port -dir I -from 31 -to 0 -type data v21_32_q1
create_bd_port -dir O v21_32_we0
create_bd_port -dir O v21_32_we1
create_bd_port -dir O -from 11 -to 0 -type data v21_33_address0
create_bd_port -dir O -from 11 -to 0 -type data v21_33_address1
create_bd_port -dir O v21_33_ce0
create_bd_port -dir O v21_33_ce1
create_bd_port -dir O -from 31 -to 0 -type data v21_33_d0
create_bd_port -dir O -from 31 -to 0 -type data v21_33_d1
create_bd_port -dir I -from 31 -to 0 -type data v21_33_q0
create_bd_port -dir I -from 31 -to 0 -type data v21_33_q1
create_bd_port -dir O v21_33_we0
create_bd_port -dir O v21_33_we1
create_bd_port -dir O -from 11 -to 0 -type data v21_34_address0
create_bd_port -dir O -from 11 -to 0 -type data v21_34_address1
create_bd_port -dir O v21_34_ce0
create_bd_port -dir O v21_34_ce1
create_bd_port -dir O -from 31 -to 0 -type data v21_34_d0
create_bd_port -dir O -from 31 -to 0 -type data v21_34_d1
create_bd_port -dir I -from 31 -to 0 -type data v21_34_q0
create_bd_port -dir I -from 31 -to 0 -type data v21_34_q1
create_bd_port -dir O v21_34_we0
create_bd_port -dir O v21_34_we1
create_bd_port -dir O -from 11 -to 0 -type data v21_35_address0
create_bd_port -dir O -from 11 -to 0 -type data v21_35_address1
create_bd_port -dir O v21_35_ce0
create_bd_port -dir O v21_35_ce1
create_bd_port -dir O -from 31 -to 0 -type data v21_35_d0
create_bd_port -dir O -from 31 -to 0 -type data v21_35_d1
create_bd_port -dir I -from 31 -to 0 -type data v21_35_q0
create_bd_port -dir I -from 31 -to 0 -type data v21_35_q1
create_bd_port -dir O v21_35_we0
create_bd_port -dir O v21_35_we1
create_bd_port -dir O -from 11 -to 0 -type data v21_36_address0
create_bd_port -dir O -from 11 -to 0 -type data v21_36_address1
create_bd_port -dir O v21_36_ce0
create_bd_port -dir O v21_36_ce1
create_bd_port -dir O -from 31 -to 0 -type data v21_36_d0
create_bd_port -dir O -from 31 -to 0 -type data v21_36_d1
create_bd_port -dir I -from 31 -to 0 -type data v21_36_q0
create_bd_port -dir I -from 31 -to 0 -type data v21_36_q1
create_bd_port -dir O v21_36_we0
create_bd_port -dir O v21_36_we1
create_bd_port -dir O -from 11 -to 0 -type data v21_37_address0
create_bd_port -dir O -from 11 -to 0 -type data v21_37_address1
create_bd_port -dir O v21_37_ce0
create_bd_port -dir O v21_37_ce1
create_bd_port -dir O -from 31 -to 0 -type data v21_37_d0
create_bd_port -dir O -from 31 -to 0 -type data v21_37_d1
create_bd_port -dir I -from 31 -to 0 -type data v21_37_q0
create_bd_port -dir I -from 31 -to 0 -type data v21_37_q1
create_bd_port -dir O v21_37_we0
create_bd_port -dir O v21_37_we1
create_bd_port -dir O -from 11 -to 0 -type data v21_38_address0
create_bd_port -dir O -from 11 -to 0 -type data v21_38_address1
create_bd_port -dir O v21_38_ce0
create_bd_port -dir O v21_38_ce1
create_bd_port -dir O -from 31 -to 0 -type data v21_38_d0
create_bd_port -dir O -from 31 -to 0 -type data v21_38_d1
create_bd_port -dir I -from 31 -to 0 -type data v21_38_q0
create_bd_port -dir I -from 31 -to 0 -type data v21_38_q1
create_bd_port -dir O v21_38_we0
create_bd_port -dir O v21_38_we1
create_bd_port -dir O -from 11 -to 0 -type data v21_39_address0
create_bd_port -dir O -from 11 -to 0 -type data v21_39_address1
create_bd_port -dir O v21_39_ce0
create_bd_port -dir O v21_39_ce1
create_bd_port -dir O -from 31 -to 0 -type data v21_39_d0
create_bd_port -dir O -from 31 -to 0 -type data v21_39_d1
create_bd_port -dir I -from 31 -to 0 -type data v21_39_q0
create_bd_port -dir I -from 31 -to 0 -type data v21_39_q1
create_bd_port -dir O v21_39_we0
create_bd_port -dir O v21_39_we1
create_bd_port -dir O -from 11 -to 0 -type data v21_3_address0
create_bd_port -dir O -from 11 -to 0 -type data v21_3_address1
create_bd_port -dir O v21_3_ce0
create_bd_port -dir O v21_3_ce1
create_bd_port -dir O -from 31 -to 0 -type data v21_3_d0
create_bd_port -dir O -from 31 -to 0 -type data v21_3_d1
create_bd_port -dir I -from 31 -to 0 -type data v21_3_q0
create_bd_port -dir I -from 31 -to 0 -type data v21_3_q1
create_bd_port -dir O v21_3_we0
create_bd_port -dir O v21_3_we1
create_bd_port -dir O -from 11 -to 0 -type data v21_40_address0
create_bd_port -dir O -from 11 -to 0 -type data v21_40_address1
create_bd_port -dir O v21_40_ce0
create_bd_port -dir O v21_40_ce1
create_bd_port -dir O -from 31 -to 0 -type data v21_40_d0
create_bd_port -dir O -from 31 -to 0 -type data v21_40_d1
create_bd_port -dir I -from 31 -to 0 -type data v21_40_q0
create_bd_port -dir I -from 31 -to 0 -type data v21_40_q1
create_bd_port -dir O v21_40_we0
create_bd_port -dir O v21_40_we1
create_bd_port -dir O -from 11 -to 0 -type data v21_4_address0
create_bd_port -dir O -from 11 -to 0 -type data v21_4_address1
create_bd_port -dir O v21_4_ce0
create_bd_port -dir O v21_4_ce1
create_bd_port -dir O -from 31 -to 0 -type data v21_4_d0
create_bd_port -dir O -from 31 -to 0 -type data v21_4_d1
create_bd_port -dir I -from 31 -to 0 -type data v21_4_q0
create_bd_port -dir I -from 31 -to 0 -type data v21_4_q1
create_bd_port -dir O v21_4_we0
create_bd_port -dir O v21_4_we1
create_bd_port -dir O -from 11 -to 0 -type data v21_5_address0
create_bd_port -dir O -from 11 -to 0 -type data v21_5_address1
create_bd_port -dir O v21_5_ce0
create_bd_port -dir O v21_5_ce1
create_bd_port -dir O -from 31 -to 0 -type data v21_5_d0
create_bd_port -dir O -from 31 -to 0 -type data v21_5_d1
create_bd_port -dir I -from 31 -to 0 -type data v21_5_q0
create_bd_port -dir I -from 31 -to 0 -type data v21_5_q1
create_bd_port -dir O v21_5_we0
create_bd_port -dir O v21_5_we1
create_bd_port -dir O -from 11 -to 0 -type data v21_6_address0
create_bd_port -dir O -from 11 -to 0 -type data v21_6_address1
create_bd_port -dir O v21_6_ce0
create_bd_port -dir O v21_6_ce1
create_bd_port -dir O -from 31 -to 0 -type data v21_6_d0
create_bd_port -dir O -from 31 -to 0 -type data v21_6_d1
create_bd_port -dir I -from 31 -to 0 -type data v21_6_q0
create_bd_port -dir I -from 31 -to 0 -type data v21_6_q1
create_bd_port -dir O v21_6_we0
create_bd_port -dir O v21_6_we1
create_bd_port -dir O -from 11 -to 0 -type data v21_7_address0
create_bd_port -dir O -from 11 -to 0 -type data v21_7_address1
create_bd_port -dir O v21_7_ce0
create_bd_port -dir O v21_7_ce1
create_bd_port -dir O -from 31 -to 0 -type data v21_7_d0
create_bd_port -dir O -from 31 -to 0 -type data v21_7_d1
create_bd_port -dir I -from 31 -to 0 -type data v21_7_q0
create_bd_port -dir I -from 31 -to 0 -type data v21_7_q1
create_bd_port -dir O v21_7_we0
create_bd_port -dir O v21_7_we1
create_bd_port -dir O -from 11 -to 0 -type data v21_8_address0
create_bd_port -dir O -from 11 -to 0 -type data v21_8_address1
create_bd_port -dir O v21_8_ce0
create_bd_port -dir O v21_8_ce1
create_bd_port -dir O -from 31 -to 0 -type data v21_8_d0
create_bd_port -dir O -from 31 -to 0 -type data v21_8_d1
create_bd_port -dir I -from 31 -to 0 -type data v21_8_q0
create_bd_port -dir I -from 31 -to 0 -type data v21_8_q1
create_bd_port -dir O v21_8_we0
create_bd_port -dir O v21_8_we1
create_bd_port -dir O -from 11 -to 0 -type data v21_9_address0
create_bd_port -dir O -from 11 -to 0 -type data v21_9_address1
create_bd_port -dir O v21_9_ce0
create_bd_port -dir O v21_9_ce1
create_bd_port -dir O -from 31 -to 0 -type data v21_9_d0
create_bd_port -dir O -from 31 -to 0 -type data v21_9_d1
create_bd_port -dir I -from 31 -to 0 -type data v21_9_q0
create_bd_port -dir I -from 31 -to 0 -type data v21_9_q1
create_bd_port -dir O v21_9_we0
create_bd_port -dir O v21_9_we1
create_bd_port -dir O -from 8 -to 0 -type data v22_address0
create_bd_port -dir O -from 8 -to 0 -type data v22_address1
create_bd_port -dir O v22_ce0
create_bd_port -dir O v22_ce1
create_bd_port -dir O -from 31 -to 0 -type data v22_d0
create_bd_port -dir O -from 31 -to 0 -type data v22_d1
create_bd_port -dir I -from 31 -to 0 -type data v22_q0
create_bd_port -dir I -from 31 -to 0 -type data v22_q1
create_bd_port -dir O v22_we0
create_bd_port -dir O v22_we1
create_bd_port -dir O -from 3 -to 0 -type data v23_0_address0
create_bd_port -dir O -from 3 -to 0 -type data v23_0_address1
create_bd_port -dir O v23_0_ce0
create_bd_port -dir O v23_0_ce1
create_bd_port -dir O -from 31 -to 0 -type data v23_0_d0
create_bd_port -dir O -from 31 -to 0 -type data v23_0_d1
create_bd_port -dir I -from 31 -to 0 -type data v23_0_q0
create_bd_port -dir I -from 31 -to 0 -type data v23_0_q1
create_bd_port -dir O v23_0_we0
create_bd_port -dir O v23_0_we1
create_bd_port -dir O -from 3 -to 0 -type data v23_10_address0
create_bd_port -dir O -from 3 -to 0 -type data v23_10_address1
create_bd_port -dir O v23_10_ce0
create_bd_port -dir O v23_10_ce1
create_bd_port -dir O -from 31 -to 0 -type data v23_10_d0
create_bd_port -dir O -from 31 -to 0 -type data v23_10_d1
create_bd_port -dir I -from 31 -to 0 -type data v23_10_q0
create_bd_port -dir I -from 31 -to 0 -type data v23_10_q1
create_bd_port -dir O v23_10_we0
create_bd_port -dir O v23_10_we1
create_bd_port -dir O -from 3 -to 0 -type data v23_11_address0
create_bd_port -dir O -from 3 -to 0 -type data v23_11_address1
create_bd_port -dir O v23_11_ce0
create_bd_port -dir O v23_11_ce1
create_bd_port -dir O -from 31 -to 0 -type data v23_11_d0
create_bd_port -dir O -from 31 -to 0 -type data v23_11_d1
create_bd_port -dir I -from 31 -to 0 -type data v23_11_q0
create_bd_port -dir I -from 31 -to 0 -type data v23_11_q1
create_bd_port -dir O v23_11_we0
create_bd_port -dir O v23_11_we1
create_bd_port -dir O -from 3 -to 0 -type data v23_12_address0
create_bd_port -dir O -from 3 -to 0 -type data v23_12_address1
create_bd_port -dir O v23_12_ce0
create_bd_port -dir O v23_12_ce1
create_bd_port -dir O -from 31 -to 0 -type data v23_12_d0
create_bd_port -dir O -from 31 -to 0 -type data v23_12_d1
create_bd_port -dir I -from 31 -to 0 -type data v23_12_q0
create_bd_port -dir I -from 31 -to 0 -type data v23_12_q1
create_bd_port -dir O v23_12_we0
create_bd_port -dir O v23_12_we1
create_bd_port -dir O -from 3 -to 0 -type data v23_13_address0
create_bd_port -dir O -from 3 -to 0 -type data v23_13_address1
create_bd_port -dir O v23_13_ce0
create_bd_port -dir O v23_13_ce1
create_bd_port -dir O -from 31 -to 0 -type data v23_13_d0
create_bd_port -dir O -from 31 -to 0 -type data v23_13_d1
create_bd_port -dir I -from 31 -to 0 -type data v23_13_q0
create_bd_port -dir I -from 31 -to 0 -type data v23_13_q1
create_bd_port -dir O v23_13_we0
create_bd_port -dir O v23_13_we1
create_bd_port -dir O -from 3 -to 0 -type data v23_14_address0
create_bd_port -dir O -from 3 -to 0 -type data v23_14_address1
create_bd_port -dir O v23_14_ce0
create_bd_port -dir O v23_14_ce1
create_bd_port -dir O -from 31 -to 0 -type data v23_14_d0
create_bd_port -dir O -from 31 -to 0 -type data v23_14_d1
create_bd_port -dir I -from 31 -to 0 -type data v23_14_q0
create_bd_port -dir I -from 31 -to 0 -type data v23_14_q1
create_bd_port -dir O v23_14_we0
create_bd_port -dir O v23_14_we1
create_bd_port -dir O -from 3 -to 0 -type data v23_15_address0
create_bd_port -dir O -from 3 -to 0 -type data v23_15_address1
create_bd_port -dir O v23_15_ce0
create_bd_port -dir O v23_15_ce1
create_bd_port -dir O -from 31 -to 0 -type data v23_15_d0
create_bd_port -dir O -from 31 -to 0 -type data v23_15_d1
create_bd_port -dir I -from 31 -to 0 -type data v23_15_q0
create_bd_port -dir I -from 31 -to 0 -type data v23_15_q1
create_bd_port -dir O v23_15_we0
create_bd_port -dir O v23_15_we1
create_bd_port -dir O -from 3 -to 0 -type data v23_16_address0
create_bd_port -dir O -from 3 -to 0 -type data v23_16_address1
create_bd_port -dir O v23_16_ce0
create_bd_port -dir O v23_16_ce1
create_bd_port -dir O -from 31 -to 0 -type data v23_16_d0
create_bd_port -dir O -from 31 -to 0 -type data v23_16_d1
create_bd_port -dir I -from 31 -to 0 -type data v23_16_q0
create_bd_port -dir I -from 31 -to 0 -type data v23_16_q1
create_bd_port -dir O v23_16_we0
create_bd_port -dir O v23_16_we1
create_bd_port -dir O -from 3 -to 0 -type data v23_17_address0
create_bd_port -dir O -from 3 -to 0 -type data v23_17_address1
create_bd_port -dir O v23_17_ce0
create_bd_port -dir O v23_17_ce1
create_bd_port -dir O -from 31 -to 0 -type data v23_17_d0
create_bd_port -dir O -from 31 -to 0 -type data v23_17_d1
create_bd_port -dir I -from 31 -to 0 -type data v23_17_q0
create_bd_port -dir I -from 31 -to 0 -type data v23_17_q1
create_bd_port -dir O v23_17_we0
create_bd_port -dir O v23_17_we1
create_bd_port -dir O -from 3 -to 0 -type data v23_18_address0
create_bd_port -dir O -from 3 -to 0 -type data v23_18_address1
create_bd_port -dir O v23_18_ce0
create_bd_port -dir O v23_18_ce1
create_bd_port -dir O -from 31 -to 0 -type data v23_18_d0
create_bd_port -dir O -from 31 -to 0 -type data v23_18_d1
create_bd_port -dir I -from 31 -to 0 -type data v23_18_q0
create_bd_port -dir I -from 31 -to 0 -type data v23_18_q1
create_bd_port -dir O v23_18_we0
create_bd_port -dir O v23_18_we1
create_bd_port -dir O -from 3 -to 0 -type data v23_19_address0
create_bd_port -dir O -from 3 -to 0 -type data v23_19_address1
create_bd_port -dir O v23_19_ce0
create_bd_port -dir O v23_19_ce1
create_bd_port -dir O -from 31 -to 0 -type data v23_19_d0
create_bd_port -dir O -from 31 -to 0 -type data v23_19_d1
create_bd_port -dir I -from 31 -to 0 -type data v23_19_q0
create_bd_port -dir I -from 31 -to 0 -type data v23_19_q1
create_bd_port -dir O v23_19_we0
create_bd_port -dir O v23_19_we1
create_bd_port -dir O -from 3 -to 0 -type data v23_1_address0
create_bd_port -dir O -from 3 -to 0 -type data v23_1_address1
create_bd_port -dir O v23_1_ce0
create_bd_port -dir O v23_1_ce1
create_bd_port -dir O -from 31 -to 0 -type data v23_1_d0
create_bd_port -dir O -from 31 -to 0 -type data v23_1_d1
create_bd_port -dir I -from 31 -to 0 -type data v23_1_q0
create_bd_port -dir I -from 31 -to 0 -type data v23_1_q1
create_bd_port -dir O v23_1_we0
create_bd_port -dir O v23_1_we1
create_bd_port -dir O -from 3 -to 0 -type data v23_20_address0
create_bd_port -dir O -from 3 -to 0 -type data v23_20_address1
create_bd_port -dir O v23_20_ce0
create_bd_port -dir O v23_20_ce1
create_bd_port -dir O -from 31 -to 0 -type data v23_20_d0
create_bd_port -dir O -from 31 -to 0 -type data v23_20_d1
create_bd_port -dir I -from 31 -to 0 -type data v23_20_q0
create_bd_port -dir I -from 31 -to 0 -type data v23_20_q1
create_bd_port -dir O v23_20_we0
create_bd_port -dir O v23_20_we1
create_bd_port -dir O -from 3 -to 0 -type data v23_21_address0
create_bd_port -dir O -from 3 -to 0 -type data v23_21_address1
create_bd_port -dir O v23_21_ce0
create_bd_port -dir O v23_21_ce1
create_bd_port -dir O -from 31 -to 0 -type data v23_21_d0
create_bd_port -dir O -from 31 -to 0 -type data v23_21_d1
create_bd_port -dir I -from 31 -to 0 -type data v23_21_q0
create_bd_port -dir I -from 31 -to 0 -type data v23_21_q1
create_bd_port -dir O v23_21_we0
create_bd_port -dir O v23_21_we1
create_bd_port -dir O -from 3 -to 0 -type data v23_22_address0
create_bd_port -dir O -from 3 -to 0 -type data v23_22_address1
create_bd_port -dir O v23_22_ce0
create_bd_port -dir O v23_22_ce1
create_bd_port -dir O -from 31 -to 0 -type data v23_22_d0
create_bd_port -dir O -from 31 -to 0 -type data v23_22_d1
create_bd_port -dir I -from 31 -to 0 -type data v23_22_q0
create_bd_port -dir I -from 31 -to 0 -type data v23_22_q1
create_bd_port -dir O v23_22_we0
create_bd_port -dir O v23_22_we1
create_bd_port -dir O -from 3 -to 0 -type data v23_23_address0
create_bd_port -dir O -from 3 -to 0 -type data v23_23_address1
create_bd_port -dir O v23_23_ce0
create_bd_port -dir O v23_23_ce1
create_bd_port -dir O -from 31 -to 0 -type data v23_23_d0
create_bd_port -dir O -from 31 -to 0 -type data v23_23_d1
create_bd_port -dir I -from 31 -to 0 -type data v23_23_q0
create_bd_port -dir I -from 31 -to 0 -type data v23_23_q1
create_bd_port -dir O v23_23_we0
create_bd_port -dir O v23_23_we1
create_bd_port -dir O -from 3 -to 0 -type data v23_24_address0
create_bd_port -dir O -from 3 -to 0 -type data v23_24_address1
create_bd_port -dir O v23_24_ce0
create_bd_port -dir O v23_24_ce1
create_bd_port -dir O -from 31 -to 0 -type data v23_24_d0
create_bd_port -dir O -from 31 -to 0 -type data v23_24_d1
create_bd_port -dir I -from 31 -to 0 -type data v23_24_q0
create_bd_port -dir I -from 31 -to 0 -type data v23_24_q1
create_bd_port -dir O v23_24_we0
create_bd_port -dir O v23_24_we1
create_bd_port -dir O -from 3 -to 0 -type data v23_25_address0
create_bd_port -dir O -from 3 -to 0 -type data v23_25_address1
create_bd_port -dir O v23_25_ce0
create_bd_port -dir O v23_25_ce1
create_bd_port -dir O -from 31 -to 0 -type data v23_25_d0
create_bd_port -dir O -from 31 -to 0 -type data v23_25_d1
create_bd_port -dir I -from 31 -to 0 -type data v23_25_q0
create_bd_port -dir I -from 31 -to 0 -type data v23_25_q1
create_bd_port -dir O v23_25_we0
create_bd_port -dir O v23_25_we1
create_bd_port -dir O -from 3 -to 0 -type data v23_26_address0
create_bd_port -dir O -from 3 -to 0 -type data v23_26_address1
create_bd_port -dir O v23_26_ce0
create_bd_port -dir O v23_26_ce1
create_bd_port -dir O -from 31 -to 0 -type data v23_26_d0
create_bd_port -dir O -from 31 -to 0 -type data v23_26_d1
create_bd_port -dir I -from 31 -to 0 -type data v23_26_q0
create_bd_port -dir I -from 31 -to 0 -type data v23_26_q1
create_bd_port -dir O v23_26_we0
create_bd_port -dir O v23_26_we1
create_bd_port -dir O -from 3 -to 0 -type data v23_27_address0
create_bd_port -dir O -from 3 -to 0 -type data v23_27_address1
create_bd_port -dir O v23_27_ce0
